# EAGLE design C128_U36_1MB_V2 (EAGLE 9.6.2)
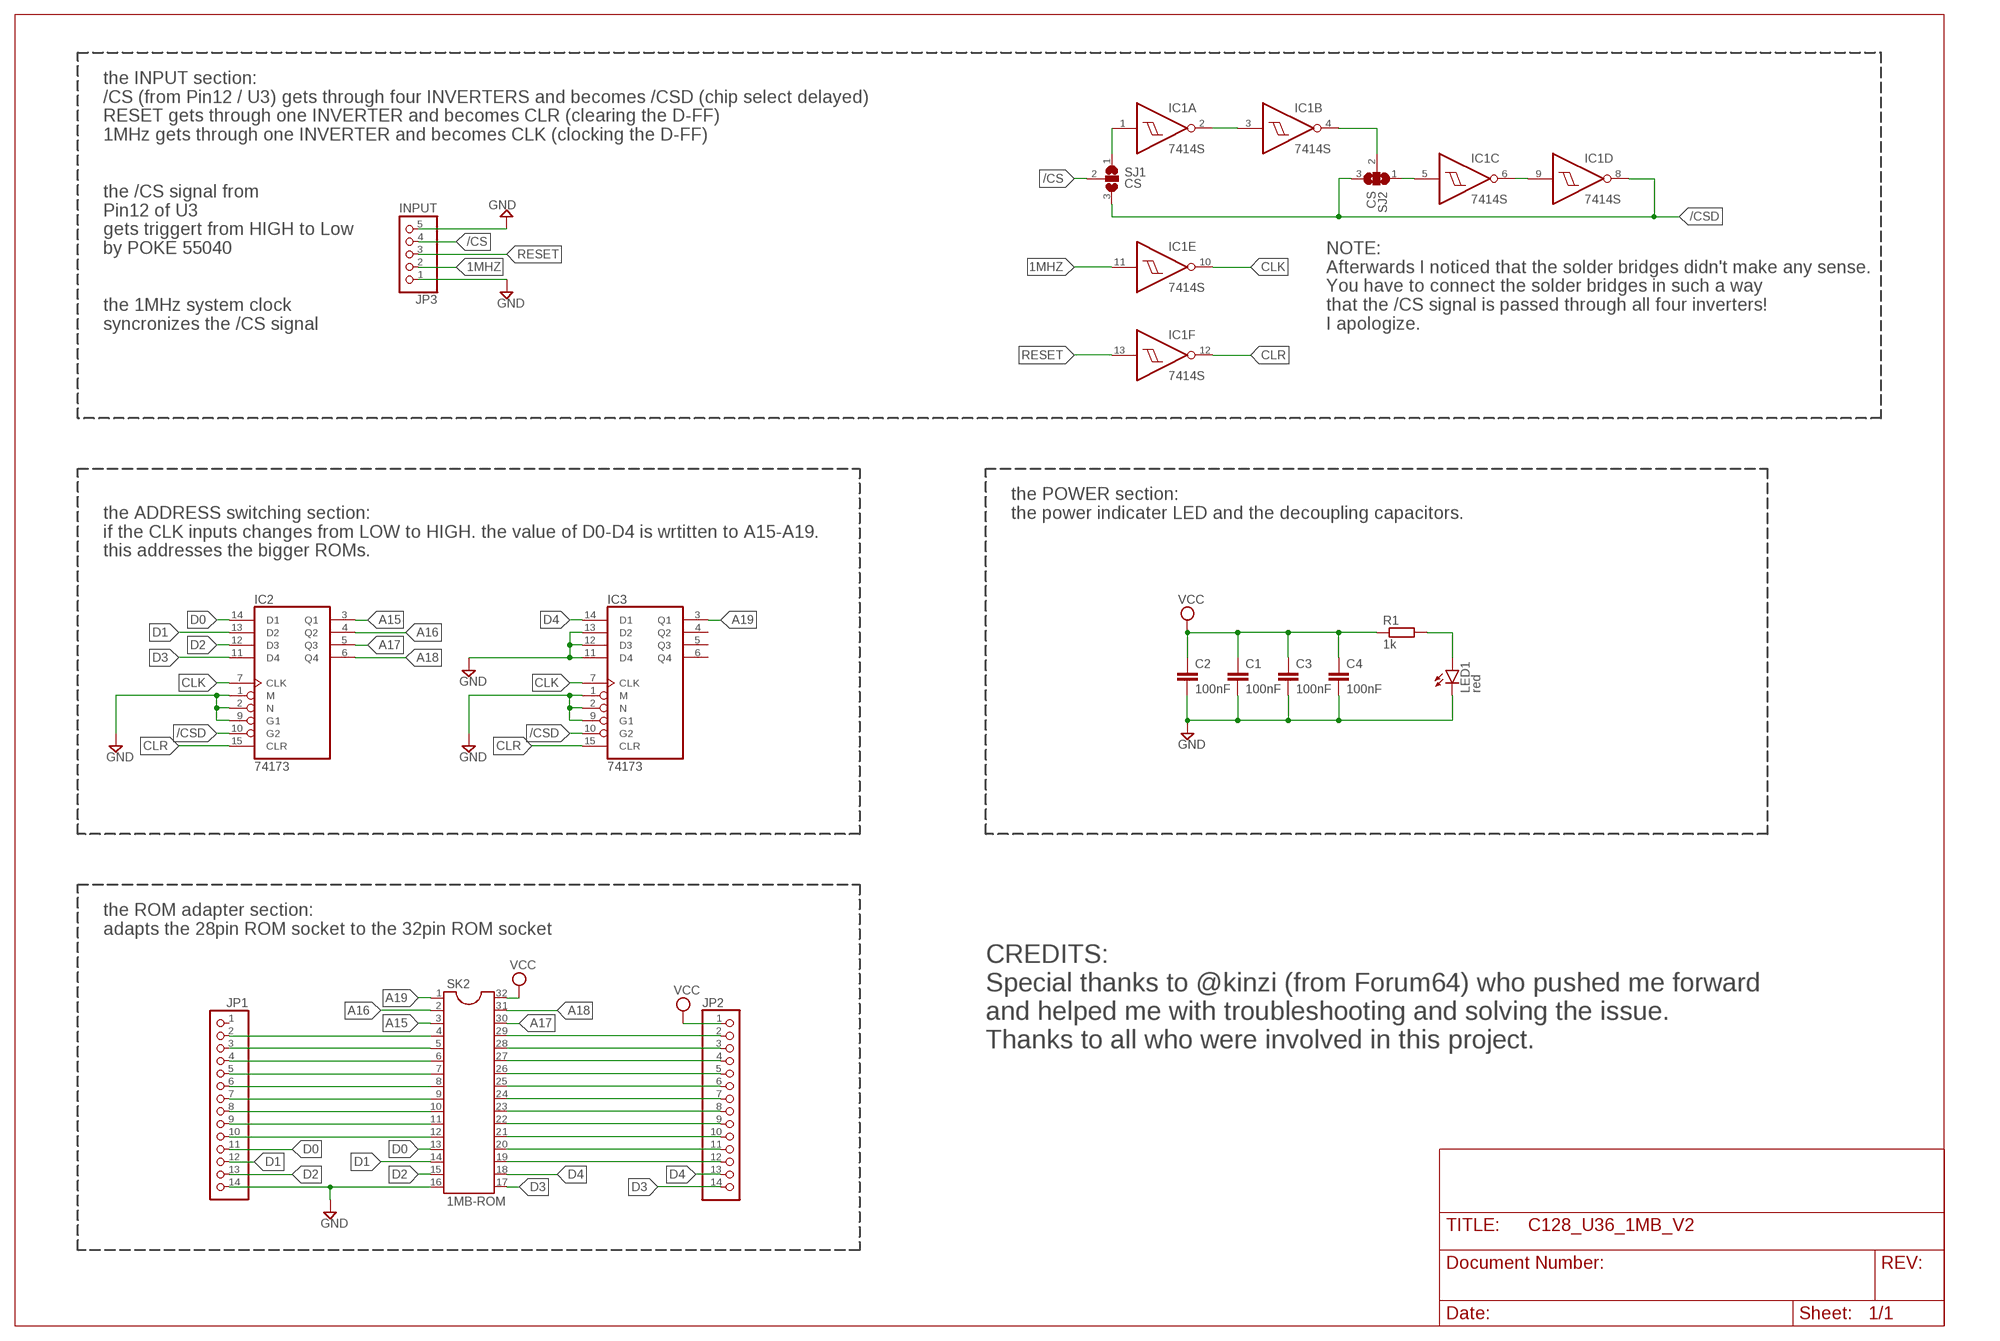
[diagram p0: schematic, sheet 1]

## Parts
C1  100nF  C-EUC0603K  [C0603K]
C2  100nF  C-EUC0603K  [C0603K]
C3  100nF  C-EUC0603K  [C0603K]
C4  100nF  C-EUC0603K  [C0603K]
IC1  7414S  7414SMALL  [SO14_DET]
IC2  74173  [SO16_DET]
IC3  74173  [SO16_DET]
JP1  PINHD-1X14  [1X14]
JP2  PINHD-1X14  [1X14]
JP3  INPUT  PINHD-1X5/90  [1X05/90]
LED1  red  LEDCHIPLED_0603  [CHIPLED_0603]
R1  1k  R-EU_R0603  [R0603]
SJ1  CS  SJ2W  [SJ_2]
SJ2  CS  SJ2W  [SJ_2]
SK2  1MB-ROM  DIL32  [DIL32]

## Nets
1MHZ: IC1.11(E:I) JP3.2
/CS: JP3.4 SJ1.2
/CSD: IC1.8(D:O) IC2.10(G2) IC3.10(G2) SJ1.3 SJ2.3
A15: IC2.3(Q1) SK2.3
A16: IC2.4(Q2) SK2.2
A17: IC2.5(Q3) SK2.30
A18: IC2.6(Q4) SK2.31
A19: IC3.3(Q1) SK2.1
CLK: IC1.10(E:O) IC2.7(CLK) IC3.7(CLK)
CLR: IC1.12(F:O) IC2.15(CLR) IC3.15(CLR)
D0: IC2.14(D1) JP1.11 SK2.13
D1: IC2.13(D2) JP1.12 SK2.14
D2: IC2.12(D3) JP1.13 SK2.15
D3: IC2.11(D4) JP2.14 SK2.17
D4: IC3.14(D1) JP2.13 SK2.18
GND: C1.2 C2.2 C3.2 C4.2 IC2.1(M) IC2.2(N) IC2.9(G1) IC3.1(M) IC3.2(N) IC3.9(G1) IC3.11(D4) IC3.12(D3) IC3.13(D2) JP1.14 JP3.1 JP3.5 LED1.C SK2.16
N$1: IC1.1(A:I) SJ1.1
N$2: IC1.2(A:O) IC1.3(B:I)
N$3: IC1.4(B:O) SJ2.2
N$4: LED1.A R1.2
N$5: IC1.5(C:I) SJ2.1
N$6: IC1.6(C:O) IC1.9(D:I)
N$21: JP1.2 SK2.4
N$22: JP1.3 SK2.5
N$23: JP1.4 SK2.6
N$24: JP1.5 SK2.7
N$25: JP1.6 SK2.8
N$26: JP1.7 SK2.9
N$27: JP1.8 SK2.10
N$28: JP1.9 SK2.11
N$29: JP2.2 SK2.29
N$30: JP2.3 SK2.28
N$31: JP2.4 SK2.27
N$32: JP2.5 SK2.26
N$33: JP2.6 SK2.25
N$34: JP2.7 SK2.24
N$35: JP2.8 SK2.23
N$36: JP2.9 SK2.22
N$37: JP2.10 SK2.21
N$38: JP2.11 SK2.20
N$39: JP2.12 SK2.19
N$40: JP1.10 SK2.12
RESET: IC1.13(F:I) JP3.3
VCC: C1.1 C2.1 C3.1 C4.1 JP2.1 R1.1 SK2.32
Unconnected: IC3.4(Q2) IC3.5(Q3) IC3.6(Q4) JP1.1

## Notes on the sheet
- the INPUT section:
  /CS (from Pin12 / U3) gets through four INVERTERS and becomes /CSD (chip select delayed)
  RESET gets through one INVERTER and becomes CLR (clearing the D-FF)
  1MHz gets through one INVERTER and becomes CLK (clocking the D-FF)
- the /CS signal from
  Pin12 of U3
  gets triggert from HIGH to Low
  by POKE 55040
- the 1MHz system clock
  syncronizes the /CS signal
- NOTE:
  Afterwards I noticed that the solder bridges didn't make any sense.
  You have to connect the solder bridges in such a way 
  that the /CS signal is passed through all four inverters! 
  I apologize.
- the POWER section:
  the power indicater LED and the decoupling capacitors.
- the ADDRESS switching section:
  if the CLK inputs changes from LOW to HIGH. the value of D0-D4 is wrtitten to A15-A19.
  this addresses the bigger ROMs.
- the ROM adapter section:
  adapts the 28pin ROM socket to the 32pin ROM socket
- CREDITS:
  Special thanks to @kinzi (from Forum64) who pushed me forward 
  and helped me with troubleshooting and solving the issue.
  Thanks to all who were involved in this project.

## Power pins joined to a net without a drawn wire
GND: IC1.7(P:GND) IC2.8(GND) IC3.8(GND)
VCC: IC1.14(P:VCC) IC2.16(VCC) IC3.16(VCC)

## Library data of the parts
C1-C4 = C128_U36_1MB:C-EU: CAPACITOR, European symbol; SPICEPREFIX: C
IC1 = C128_U36_1MB:74*14: Hex schmitt trigger INVERTER
IC2 = C128_U36_1MB:74*173: 4-bit D type REGISTER, 3-state
IC3 = C128_U36_1MB:74*173: 4-bit D type REGISTER, 3-state; SPICEPREFIX: X
JP1 JP2 = C128_U36_1MB:PINHD-1X14: PIN HEADER
JP3 = C128_U36_1MB:PINHD-1X5: PIN HEADER
LED1 = C128_U36_1MB:LED: LED OSRAM: - CHIPLED LG R971, LG N971, LY N971, LG Q971, LY Q971, LO R971, LY R971 LH N974, LH R974 LS Q976, LO Q976, LY Q976 LO Q996 - Hyper CHIPLED LW Q18S LB Q993, LB Q99A, LB R99A - SideLED LS A670, LO A670, LY A670, LG A670, LP A670 LB A673, LV A673, LT A673, LW A673 LH A674 LY A675 LS A676, LA A676, LO A676, LY A676, LW A676 LS A679, LY A679, LG A679 - Hyper Micro SIDELED® LS Y876, LA Y876, LO Y876, LY Y876 LT Y87S - SmartLED LW L88C, LW L88S LB L89C, LB L89S, LG L890 LS L89K, LO L89K, LY L89K LS L896, LA L896, LO L896, LY L896 - TOPLED LS T670, LO T670, LY T670, LG T670, LP T670 LSG T670, LSP T670, LSY T670, LOP T670, LYG T670 LG T671, LOG T671, LSG T671 LB T673, LV T673, LT T673, LW T673 LH T674 LS T676, LA T676, LO T676, LY T676, LB T676, LH T676, LSB T676, LW T676 LB T67C, LV T67C, LT T67C, LS T67K, LO T67K, LY T67K, LW E67C LS E67B, LA E67B, LO E67B, LY E67B, LB E67C, LV E67C, LT E67C LW T67C LS T679, LY T679, LG T679 LS T770, LO T770, LY T770, LG T770, LP T770 LB T773, LV T773, LT T773, LW T773 LH T774 LS E675, LA E675, LY E675, LS T675 LS T776, LA T776, LO T776, LY T776, LB T776 LHGB T686 LT T68C, LB T68C - Hyper Mini TOPLED® LB M676 - Mini TOPLED Santana® LG M470 LS M47K, LO M47K, LY M47K Source: http://www.osram.convergy.de LUXEON: - LUMILED® LXK2-PW12-R00, LXK2-PW12-S00, LXK2-PW14-U00, LXK2-PW14-V00 LXK2-PM12-R00, LXK2-PM12-S00, LXK2-PM14-U00 LXK2-PE12-Q00, LXK2-PE12-R00, LXK2-PE12-S00, LXK2-PE14-T00, LXK2-PE14-U00 LXK2-PB12-K00, LXK2-PB12-L00, LXK2-PB12-M00, LXK2-PB14-N00, LXK2-PB14-P00, LXK2-PB14-Q00 LXK2-PR12-L00, LXK2-PR12-M00, LXK2-PR14-Q00, LXK2-PR14-R00 LXK2-PD12-Q00, LXK2-PD12-R00, LXK2-PD12-S00 LXK2-PH12-R00, LXK2-PH12-S00 LXK2-PL12-P00, LXK2-PL12-Q00, LXK2-PL12-R00 Source: www.luxeon.com KINGBRIGHT: KA-3528ASYC Source: www.kingbright.com
R1 = C128_U36_1MB:R-EU_: RESISTOR, European symbol; SPICEPREFIX: R
SJ1 SJ2 = C128_U36_1MB:SJ2W: SMD solder JUMPER
SK2 = C128_U36_1MB:DIL32: Dual In Line

## Board
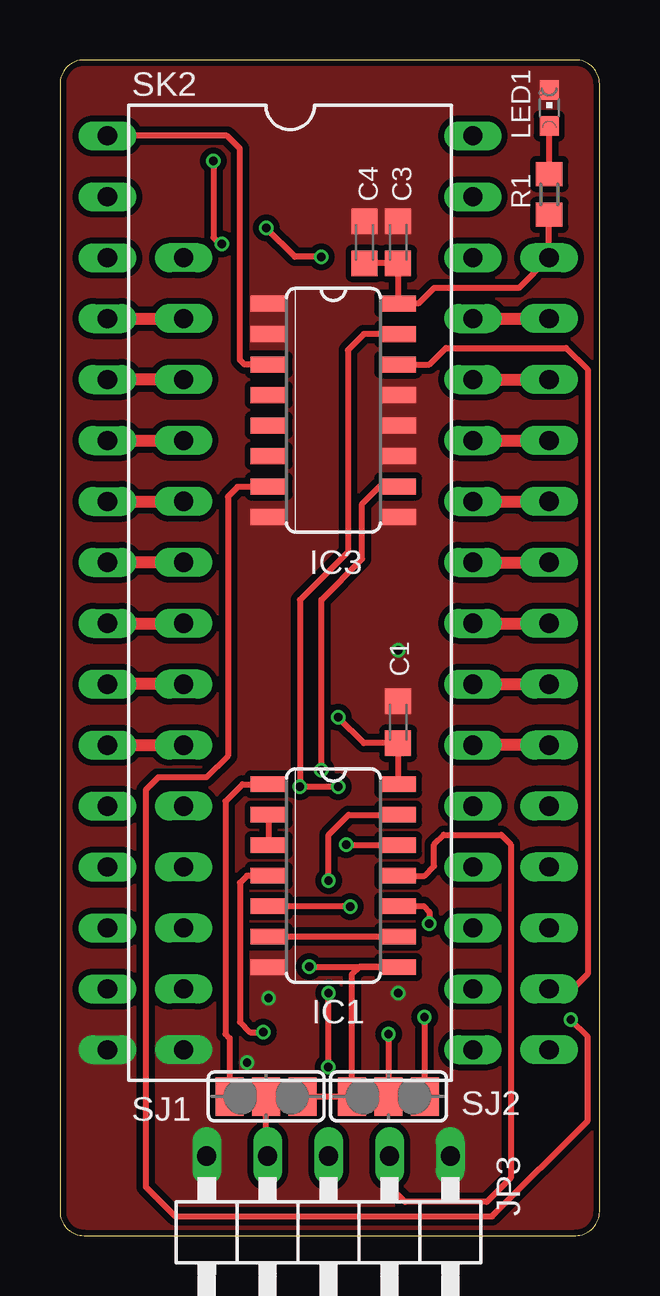
[diagram p1: board, top side]
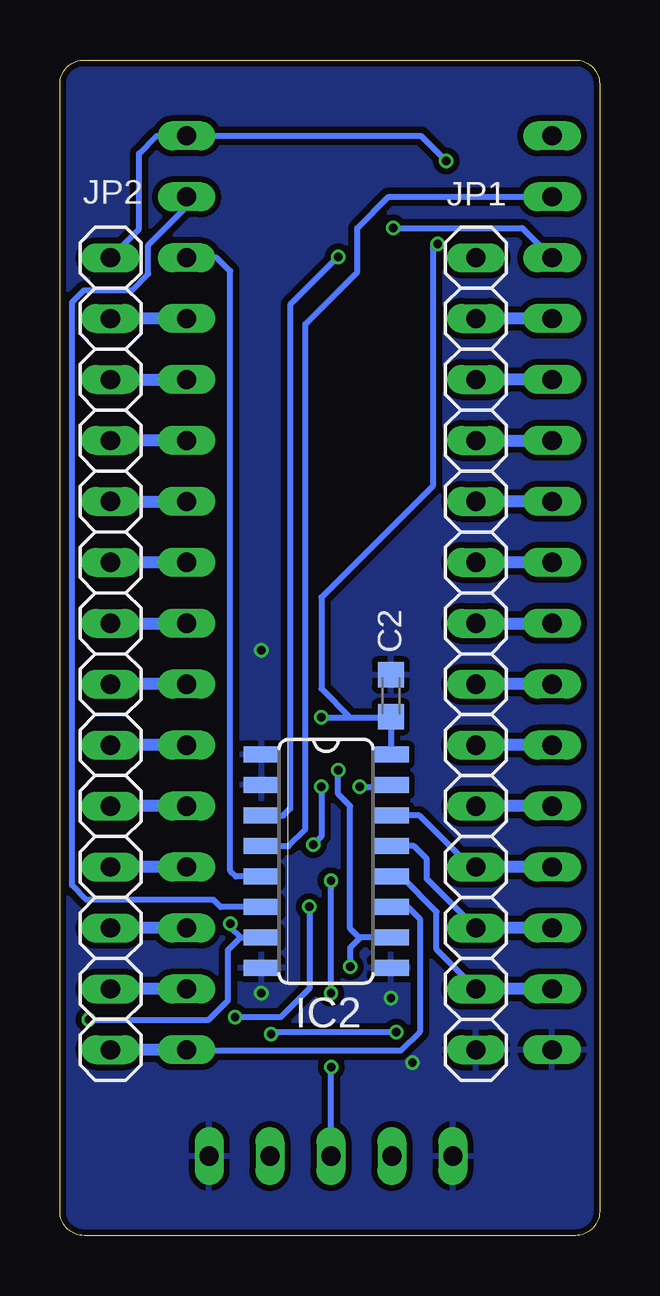
[diagram p2: board, bottom side, seen from below]

Size 22.5 x 49 mm. Coordinates in mm from the lower left corner, seen from the top.
Outline: 0,48 0,1 arc90 1,0 21.5,0 arc90 22.5,1 22.5,48 arc90 21.5,49 1,49 arc90 0,48
Copper layers (1*16): Top 0.035559375mm / dielectric 1.6mm / Bottom 0.035559375mm
Design rules "jlcpcb2layer *": minimum track width 8mil, minimum drill 12mil, track to track 10mil, track to pad 10mil, pad to pad 10mil, via to via 10mil, smd to smd 10mil, copper to edge 10mil, drill to drill 10mil, minimum pad ring 5mil, minimum via ring 3mil, stop-mask expansion 2.5mil, vias tented up to drill 0mil, thermal gap 10mil

### Footprints (pad centres in the part's own frame; a part is rotated, then mirrored left to right if it is on the bottom)
C0603K = smd 1.05 x 1.08: 1 -0.875,0; 2 0.875,0
SO14_DET = smd 0.66 x 1.5: 1 -3.81,-2.7; 2 -2.54,-2.7; 3 -1.27,-2.7; 4 0,-2.7; 5 1.27,-2.7; 6 2.54,-2.7; 7 3.81,-2.7; 8 3.81,2.7; 9 2.54,2.7; 10 1.27,2.7; 11 0,2.7; 12 -1.27,2.7; 13 -2.54,2.7; 14 -3.81,2.7
SO16_DET = smd 0.66 x 1.5: 1 -4.445,-2.7; 2 -3.175,-2.7; 3 -1.905,-2.7; 4 -0.635,-2.7; 5 0.635,-2.7; 6 1.905,-2.7; 7 3.175,-2.7; 8 4.445,-2.7; 9 4.445,2.7; 10 3.175,2.7; 11 1.905,2.7; 12 0.635,2.7; 13 -0.635,2.7; 14 -1.905,2.7; 15 -3.175,2.7; 16 -4.445,2.7
1X14 = drill 0.8 long: 1 -16.51,0; 2 -13.97,0; 3 -11.43,0; 4 -8.89,0; 5 -6.35,0; 6 -3.81,0; 7 -1.27,0; 8 1.27,0; 9 3.81,0; 10 6.35,0; 11 8.89,0; 12 11.43,0; 13 13.97,0; 14 16.51,0
1X05/90 = drill 0.8 long: 1 -5.08,-3.81; 2 -2.54,-3.81; 3 0,-3.81; 4 2.54,-3.81; 5 5.08,-3.81
CHIPLED_0603 = smd 0.8 x 0.8: A 0,-0.75; C 0,0.75
R0603 = smd 1 x 1.1: 1 -0.85,0; 2 0.85,0
SJ_2 = smd 1.168 x 1.6: 1 -1.524,0; 2 0,0; 3 1.524,0
DIL32 = drill 0.8 long: 1 -19.05,-7.62; 2 -16.51,-7.62; 3 -13.97,-7.62; 4 -11.43,-7.62; 5 -8.89,-7.62; 6 -6.35,-7.62; 7 -3.81,-7.62; 8 -1.27,-7.62; 9 1.27,-7.62; 10 3.81,-7.62; 11 6.35,-7.62; 12 8.89,-7.62; 13 11.43,-7.62; 14 13.97,-7.62; 15 16.51,-7.62; 16 19.05,-7.62; 17 19.05,7.62; 18 16.51,7.62; 19 13.97,7.62; 20 11.43,7.62; 21 8.89,7.62; 22 6.35,7.62; 23 3.81,7.62; 24 1.27,7.62; 25 -1.27,7.62; 26 -3.81,7.62; 27 -6.35,7.62; 28 -8.89,7.62; 29 -11.43,7.62; 30 -13.97,7.62; 31 -16.51,7.62; 32 -19.05,7.62

### Placement (x,y rotation side)
C1  14.1,21.4 90 top
C2  8.7,22.5 90 bottom
C3  14.1,41.4 90 top
C4  12.7,41.4 90 top
IC1  11.4,15 270 top
IC2  11.4,15.6 270 bottom
IC3  11.4,34.4 270 top
JP1  5.16,24.25 270 bottom
JP2  20.39,24.25 270 bottom
JP3  11.2,-0.5 180 top
LED1  20.4,47 0 top
R1  20.4,43.4 90 top
SJ1  8.6,5.8 0 top
SJ2  13.7,5.8 180 top
SK2  9.6,26.79 270 top

### Tracks (layer width: path | path; a pad name or v marks a point on that pad's centre or on a via)
1MHZ
  Top 0.254: IC1.11 15.2,15 15.6,15.4 15.6,16.3 16,16.7 18.4,16.7 18.8,16.3 18.8,2.4 17.8,1.4 14.4,1.4 13.74,2.06 JP3.2
/CS
  Top 0.254: JP3.4 8.6,3.37 SJ1.2
/CSD  (via drill 0.35 pad 0.6)
  Top 0.254: SJ1.3 SJ2.3 12.18,10.88 12.5,11.2 12.51,11.19 IC1.8 v10.4,11.2 | v10.9,19.4 10.9,26.5 12.6,28.2 12.6,30.5 13.32,31.23 IC3.10
  Bottom 0.254: v10.4,11.2 10.4,12 9.97,12.43 IC2.10 10.03,12.43 10.4,12.8 10.4,17.9 10.9,18.4 v10.9,19.4
A15  (via drill 0.35 pad 0.6)
  Top 0.254: v10.9,40.8 9.8,40.8 v8.6,42
  Bottom 0.254: IC2.3 13.2,17.5 12.9,17.8 12.9,38.8 v10.9,40.8 | v8.6,42 3.22,42 SK2.3
A16
  Bottom 0.254: IC2.4 12.96,16.23 12.27,16.93 12.27,37.99 10.1,40.16 10.1,42 8.8,43.3 SK2.2
A17
  Bottom 0.254: IC2.5 15.16,14.96 15.4,15.2 15.4,40.2 15.96,40.76 SK2.30
A18
  Bottom 0.254: IC2.6 15.79,13.7 16.1,14 21.4,14 22,14.6 22,38.9 21.5,39.4 19.5,39.4 18.81,40.09 18.81,41.29 17.22,42.88 SK2.31
A19
  Top 0.254: IC3.3 7.7,36.3 7.5,36.5 7.5,45.3 6.96,45.84 SK2.1
CLK  (via drill 0.35 pad 0.6)
  Top 0.254: IC3.7 8.68,31.2 7.4,31.2 7,30.8 7,20 6.1,19.1 4.1,19.1 3.57,18.57 3.57,2.03 4.81,0.79 18.01,0.79 22,4.78 22,8.3 v21.3,9 | IC1.10 15.17,13.73 15.4,13.5 v15.4,13
  Bottom 0.254: v21.3,9 16.3,9 15.5,9.8 15.5,11.9 14.97,12.43 | 14.97,12.43 IC2.7 | v15.4,13 15.4,12.85 14.97,12.43
CLR  (via drill 0.35 pad 0.6)
  Top 0.254: IC1.12 11.96,16.27 v11.93,16.3 | v11.6,18.7 v10,18.7 10,26.5 12,28.5 12,36.9 12.68,37.58 IC3.15
  Bottom 0.254: v11.93,16.3 11.6,16.63 v11.6,18.7 | v10,18.7 8.78,18.7 IC2.15
D0
  Bottom 0.254: JP1.11 5.2,15.36 5.36,15.36 7.5,17.5 IC2.14
  Bottom 0.508: SK2.13 5.2,15.36
D1
  Bottom 0.254: JP1.12 7.2,14.87 7.2,15.7 7.74,16.23 IC2.13
  Bottom 0.508: SK2.14 JP1.12
D2
  Bottom 0.254: JP1.13 6.8,11.93 6.8,13.5 8.27,14.96 IC2.12
  Bottom 0.508: SK2.15 JP1.13
D3
  Bottom 0.254: IC2.11 8,13.7 7.5,13.2 7.5,8.5 8.3,7.7 17.18,7.7 SK2.17
  Bottom 0.508: SK2.17 JP2.14
D4
  Top 0.254: IC3.14 15.4,36.3 16.1,37 21.1,37 22,36.1 22,10.9 21.38,10.28 JP2.13
  Bottom 0.508: SK2.18 JP2.13
GND  (via drill 0.35 pad 0.6)
  other vias: 8.7,9.9 7.8,7.2 14.1,10.1 14.1,24.4
  pour Top (isolate 0.254, no thermals): -1,51.5 25,51.5 25,-1 -1,-1
  pour Bottom (isolate 0.254): -0.5,51 25,51 25,-1 -0.5,-1
N$1
  Top 0.254: IC1.1 7.61,18.81 6.9,18.1 6.9,8.4 7.08,8.22 SJ1.1
N$2
  Top 0.254: IC1.2 IC1.3
N$3  (via drill 0.35 pad 0.6)
  Top 0.254: IC1.4 7.8,15 7.5,14.7 7.5,8.9 7.93,8.47 v8.47,8.47 | v13.7,8.4 SJ2.2
  Bottom 0.254: v8.47,8.47 13.63,8.47 v13.7,8.4
N$4
  Top 0.254: R1.2 LED1.A
N$5  (via drill 0.35 pad 0.6)
  Top 0.254: IC1.5 12.07,13.73 v12.1,13.7 | v15.2,9.1 15.2,5.82 SJ2.1
  Bottom 0.254: v12.1,13.7 12.1,10.3 13.3,9.1 v15.2,9.1
N$6
  Top 0.254: IC1.6 IC1.9
N$21
  Top 0.508: SK2.4 JP1.2
  Bottom 0.508: SK2.4 JP1.2
N$22
  Top 0.508: JP1.3 SK2.5
  Bottom 0.508: SK2.5 JP1.3
N$23
  Top 0.508: SK2.6 JP1.4
  Bottom 0.508: JP1.4 SK2.6
N$24
  Top 0.508: SK2.7 JP1.5
  Bottom 0.508: SK2.7 JP1.5
N$25
  Top 0.508: JP1.6 SK2.8
  Bottom 0.508: SK2.8 JP1.6
N$26
  Top 0.508: SK2.9 JP1.7
  Bottom 0.508: JP1.7 SK2.9
N$27
  Top 0.508: JP1.8 SK2.10
  Bottom 0.508: SK2.10 JP1.8
N$28
  Top 0.508: SK2.11 JP1.9
  Bottom 0.508: SK2.11 JP1.9
N$29
  Top 0.508: SK2.29 JP2.2
  Bottom 0.508: SK2.29 JP2.2
N$30
  Top 0.508: SK2.28 JP2.3
  Bottom 0.508: JP2.3 SK2.28
N$31
  Top 0.508: SK2.27 JP2.4
  Bottom 0.508: SK2.27 JP2.4
N$32
  Top 0.508: SK2.26 JP2.5
  Bottom 0.508: JP2.5 SK2.26
N$33
  Top 0.508: SK2.25 JP2.6
  Bottom 0.508: SK2.25 JP2.6
N$34
  Top 0.508: SK2.24 JP2.7
  Bottom 0.508: JP2.7 SK2.24
N$35
  Top 0.508: SK2.23 JP2.8
  Bottom 0.508: SK2.23 JP2.8
N$36
  Top 0.508: JP2.9 SK2.22
  Bottom 0.508: SK2.22 JP2.9
N$37
  Bottom 0.508: SK2.21 JP2.10
N$38
  Bottom 0.508: SK2.20 JP2.11
N$39
  Bottom 0.508: SK2.19 JP2.12
N$40
  Bottom 0.508: SK2.12 JP1.10
RESET  (via drill 0.35 pad 0.6)
  Top 0.254: v11.18,7.02 11.2,7.04 v11.2,10.1 | v11.2,14.8 11.2,16.7 12.04,17.54 IC1.13
  Bottom 0.254: v11.18,7.02 11.2,7 JP3.3 | v11.2,10.1 v11.2,14.8
VCC  (via drill 0.35 pad 0.6)
  Top 0.254: IC1.14 C1.1 12.68,20.52 v11.6,21.6 | C4.1 C3.1 IC3.16 14.95,38.84 15.6,39.5 19.14,39.5 JP2.1 R1.1 | v6.4,44.8 6.4,41.6 6.66,41.34 v6.76,41.34
  Bottom 0.254: JP2.1 19.2,41.95 19.2,45.1 18.46,45.84 SK2.32 7.44,45.84 v6.4,44.8 | v6.76,41.34 6.96,41.14 6.96,31.24 11.6,26.6 11.6,22.8 10.4,21.6 | 10.4,21.6 8.72,21.6 C2.1 IC2.16 | v11.6,21.6 10.4,21.6